# Altium project AL104_master.PrjPcb
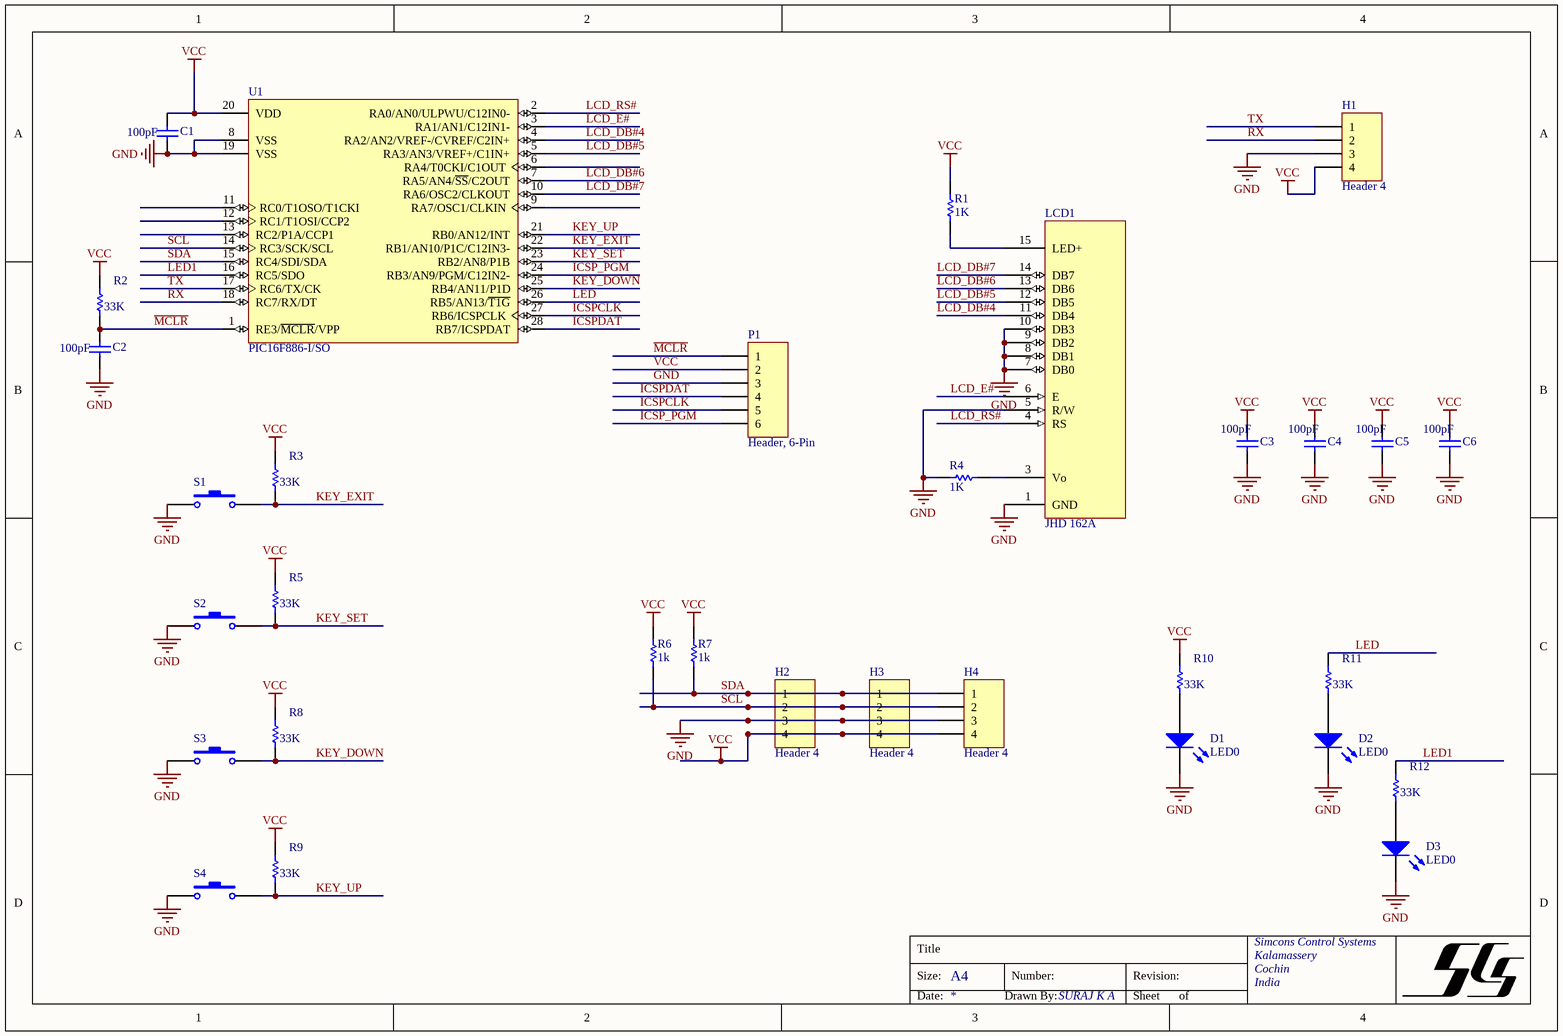
[diagram p0: processor.SchDoc]
1 sheet, 32 parts. Net scope: global (net labels, ports and power ports of the same name join across sheets).
Board file: AL104_master_v10.PcbDoc

## Sheet processor.SchDoc
size A4; Author: Suraj; DrawnBy: Suraj; Engineer: Suraj; Organization: Simcons Control Systems; Address1: Kalamassery; Address2: Cochin; Address4: India

### Parts
C1  value 100pF  [C1206_S]  (hidden comment: .1uF 1206)
C2  value 100pF  [C1206_S]  (hidden comment: .1uF 1206)
C3  value 100pF  [C1206_S]  (hidden comment: .1uF 1206)
C4  value 100pF  [C1206_S]  (hidden comment: .1uF 1206)
C5  value 100pF  [C1206_S]  (hidden comment: .1uF 1206)
C6  value 100pF  [C1206_S]  (hidden comment: .1uF 1206)
D1  LED0  [LED5mmGREEN]
D2  LED0  [LED5mmGREEN]
D3  LED0  [LED5mmGREEN]
H1  Header 4  [CONNDEBUG]
H2  Header 4  [CONNDEBUG]
H3  Header 4  [CONNDEBUG]
H4  Header 4  [CONNDEBUG]
LCD1  JHD 162A  [LCD20X4]
P1  Header, 6-Pin  [CON_ICSP]
R1  value 1K  [R1206]  (hidden comment: 470E 1206)
R2  value 33K  [R1206_W]  (hidden comment: 100K 1206)
R3  value 33K  [R1206_W]  (hidden comment: 100K 1206)
R4  value 1K  [R1206]  (hidden comment: 470E 1206)
R5  value 33K  [R1206_W]  (hidden comment: 100K 1206)
R6  value 1k  [R1206_S]  (hidden comment: 4.7K 1206)
R7  value 1k  [R1206_S]  (hidden comment: 4.7K 1206)
R8  value 33K  [R1206_W]  (hidden comment: 100K 1206)
R9  value 33K  [R1206_W]  (hidden comment: 100K 1206)
R10  value 33K  [R1206_W]  (hidden comment: 100K 1206)
R11  value 33K  [R1206_W]  (hidden comment: 100K 1206)
R12  value 33K  [R1206_W]  (hidden comment: 100K 1206)
S1  8MM DOM SWITCH  [SWITCH_1]  (value not drawn)
S2  8MM DOM SWITCH  [SWITCH_1]  (value not drawn)
S3  8MM DOM SWITCH  [SWITCH_1]  (value not drawn)
S4  8MM DOM SWITCH  [SWITCH_1]  (value not drawn)
U1  PIC16F886-I/SO  [SOIC-SO28_M]

### Nets
GND: C1.1 C2.1 C3.1 C4.1 C5.1 C6.1 D1.2(K) D2.2(K) D3.2(K) H1.3 H2.3 H3.3 H4.3 LCD1.1(GND) LCD1.5(R/W) LCD1.7(DB0) LCD1.8(DB1) LCD1.9(DB2) LCD1.10(DB3) LCD1.16(LED-) P1.3 R4.2 S1.1 S2.1 S3.1 S4.1 U1.8(VSS) U1.19(VSS)
VCC: C1.2 C3.2 C4.2 C5.2 C6.2 H1.4 H2.4 H3.4 H4.4 LCD1.2(VDD) P1.2 R1.2 R2.1 R3.1 R5.1 R6.1 R7.1 R8.1 R9.1 R10.1 U1.20(VDD)
ICSP_PGM: P1.6 U1.24(RB3/AN9/PGM/C12IN2-)
ICSPCLK: P1.5 U1.27(RB6/ICSPCLK)
ICSPDAT: P1.4 U1.28(RB7/ICSPDAT)
KEY_DOWN: R8.2 S3.2 U1.25(RB4/AN11/P1D)
KEY_EXIT: R3.2 S1.2 U1.22(RB1/AN10/P1C/C12IN3-)
KEY_SET: R5.2 S2.2 U1.23(RB2/AN8/P1B)
KEY_UP: R9.2 S4.2 U1.21(RB0/AN12/INT)
LCD_DB#4: LCD1.11(DB4) U1.4(RA2/AN2/VREF-/CVREF/C2IN+)
LCD_DB#5: LCD1.12(DB5) U1.5(RA3/AN3/VREF+/C1IN+)
LCD_DB#6: LCD1.13(DB6) U1.7(RA5/AN4/~{SS}/C2OUT)
LCD_DB#7: LCD1.14(DB7) U1.10(RA6/OSC2/CLKOUT)
LCD_E#: LCD1.6(E) U1.3(RA1/AN1/C12IN1-)
LCD_RS#: LCD1.4(RS) U1.2(RA0/AN0/ULPWU/C12IN0-)
LED: R11.1 U1.26(RB5/AN13/~{T1G})
LED1: R12.1 U1.16(RC5/SDO)
~{MCLR}: C2.2 P1.1 R2.2 U1.1(RE3/~{MCLR}/VPP)
RX: H1.2 U1.18(RC7/RX/DT)
SCL: H2.2 H3.2 H4.2 R6.2 U1.14(RC3/SCK/SCL)
SDA: H2.1 H3.1 H4.1 R7.2 U1.15(RC4/SDI/SDA)
TX: H1.1 U1.17(RC6/TX/CK)
NetD1_1: D1.1(A) R10.2
NetD2_1: D2.1(A) R11.2
NetD3_1: D3.1(A) R12.2
NetLCD1_3: LCD1.3(Vo) R4.1
NetLCD1_15: LCD1.15(LED+) R1.1

Not connected (* = marked no-connect by the designer): U1 6(RA4/T0CKI/C1OUT) 9(RA7/OSC1/CLKIN) 11(RC0/T1OSO/T1CKI) 12(RC1/T1OSI/CCP2) 13(RC2/P1A/CCP1)

### Notes on the sheet
- Title
- Size:
- A4
- Number:
- Revision:
- Simcons Control Systems
- Kalamassery
- Cochin
- India
- Date:
- Drawn By:
- SURAJ K A
- Sheet
- of

### Library data of the parts
C1-C6 = Cap: Capacitor; Published: 8-Jun-2000; LatestRevisionDate: 17-Jul-2002; LatestRevisionNote: Re-released for DXP Platform.; PackageReference: RAD-0.3; Publisher: Altium Limited; PackageDescription: Radial Cap, Thru-Hole; 2 Leads; 0.3 in Pin Spacing
D1-D3 = LED0: Typical INFRARED GaAs LED; Published: 8-Jun-2000; LatestRevisionDate: 08-Jul-2005; LatestRevisionNote: Mech Layer 1 removed.; PackageReference: LED-0; Publisher: Altium Limited; PackageDescription: LED; 2 Leads
H1-H4 = Header 4: Header, 4-Pin; LatestRevisionDate: 17-Jul-2002; LatestRevisionNote: Re-released for DXP Platform.; Publisher: Altium Limited
LCD1 = 162A: 16 char * 2 line LCD character display with b/light
P1 = Header 6: LatestRevisionDate: 17-Jul-2002; LatestRevisionNote: Re-released for DXP Platform.; Publisher: Altium Limited
R1-R5 R8-R12 = Res1: Resistor; Published: 8-Jun-2000; LatestRevisionDate: 17-Jul-2002; LatestRevisionNote: Re-released for DXP Platform.; PackageReference: AXIAL-0.4; Publisher: Altium Limited; PackageDescription: Axial Device, Thru-Hole; 2 Leads; 0.3 in Pin Spacing
R6 R7 = Res Semi: Semiconductor Resistor; Published: 8-Jun-2000; LatestRevisionDate: 17-Jul-2002; LatestRevisionNote: Re-released for DXP Platform.; PackageReference: AXIAL-0.5; Publisher: Altium Limited; PackageDescription: Axial Device, Thru-Hole; 2 Leads; 0.5 in Pin Spacing
S1-S4 = SW-PB: Switch; Published: 24-Mar-1999; LatestRevisionDate: 17-Jul-2002; LatestRevisionNote: Re-released for DXP Platform.; PackageReference: SPST-2; Publisher: Altium Limited; PackageDescription: Switch; 2 Leads
U1 = PIC16F886-I/SP: Flash-Based, 8-Bit CMOS Microcontroller with nanoWatt Technology, 8K (x14-Bit words) Program Memory, 624 Bytes Data Memory, 24 I/O pins, 28-Pin SOIC, Standard VDD Range, Industrial Temperature; Published: 29-Jan-2009; LatestRevisionDate: 02-Dec-2009; LatestRevisionNote: Updated datasheet to version revF, Apr-2009.; DatasheetVersion: revF, Apr-2009; PackageVersion: revBB, Aug-2009; PackageReference: SPDIP300-SP28; Publisher: Altium Limited; PackageDescription: 28-Lead Skinny Plastic Dual In-Line (SP) - 300 mil Body [SPDIP]; Supplier 1: Digi-Key; Supplier Part Number 1: PIC16F886-I/SO; Supplier 2: Farnell; Supplier Part Number 2: 1439539; ComponentLink1Description: Datasheet; ComponentLink1URL: http://ww1.microchip.com/downloads/en/DeviceDoc/41291F.pdf; ComponentLink2Description: Packaging Specification; ComponentLink2URL: http://www.microchip.com/stellent/groups/techpub_sg/documents/packagingspec/en012702.pdf; ComponentLink3Description: Microchip.com Home; ComponentLink3URL: http://www.microchip.com/